# Altium schematic sheet 0261_GPU PSYS CIRCUIT.SchDoc
size 848 x 558 mm
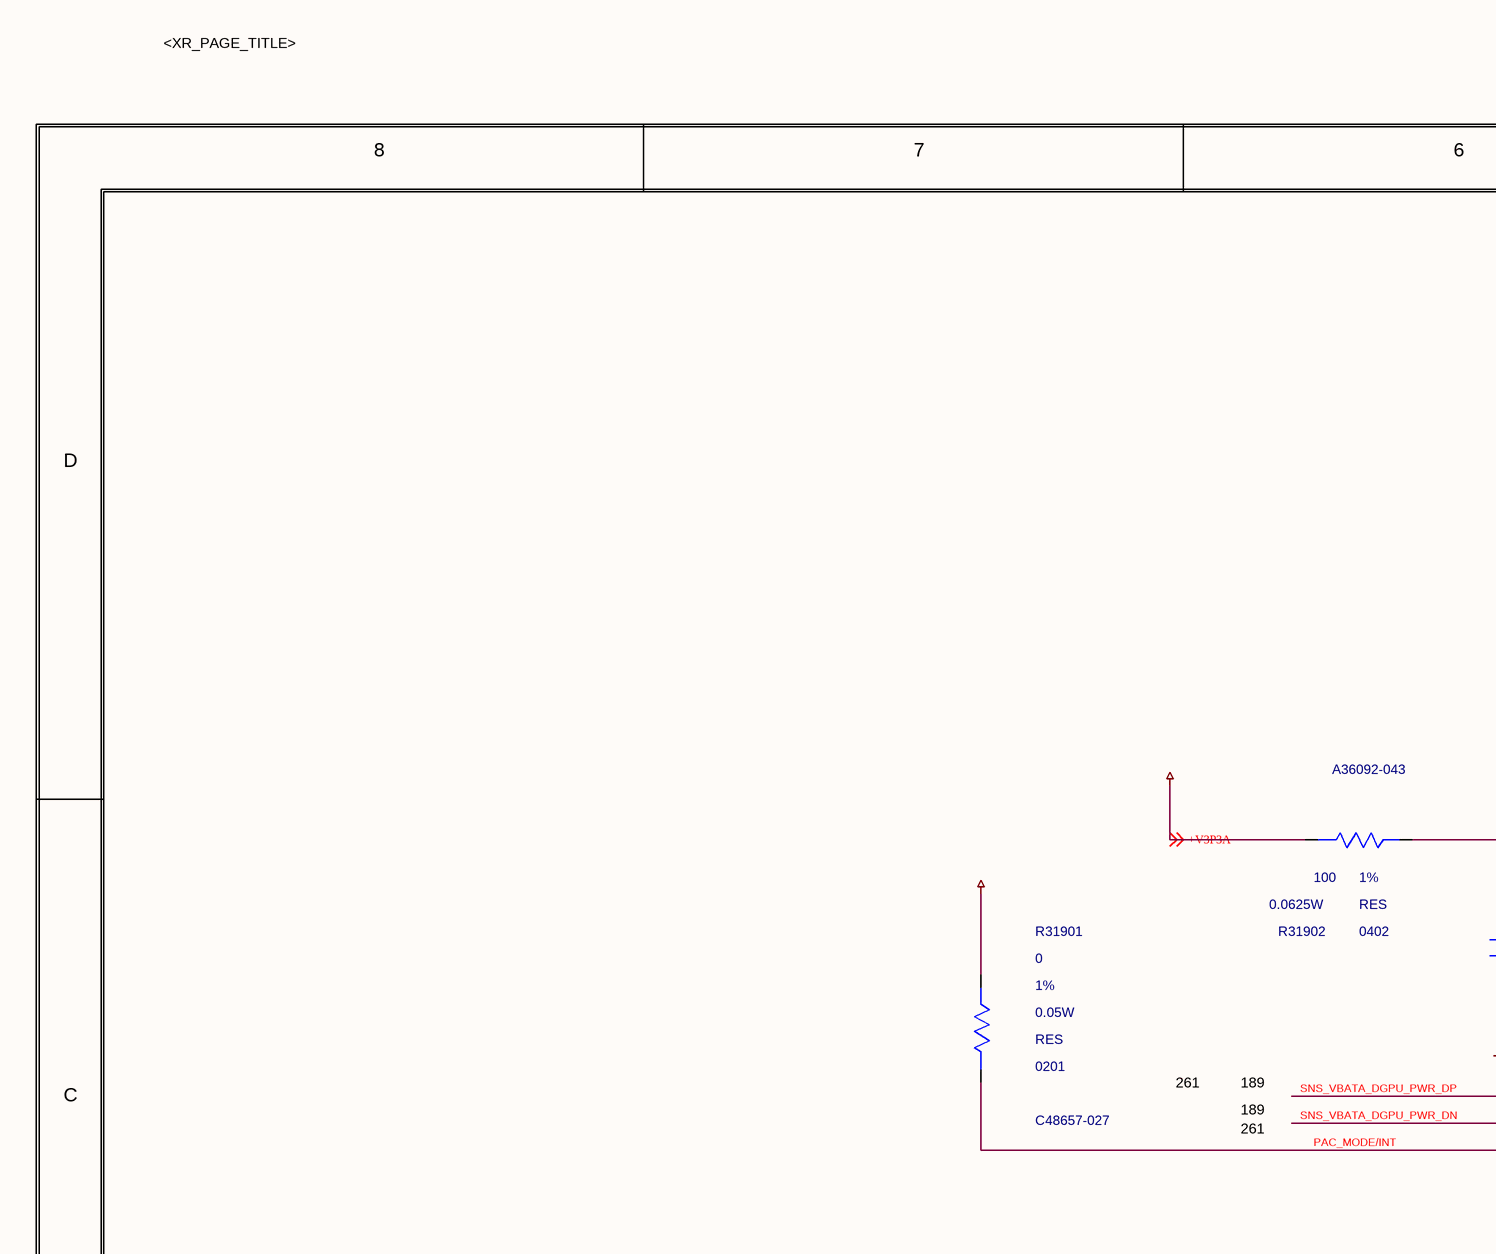
[diagram p0: 0261_GPU PSYS CIRCUIT.SchDoc, top left]
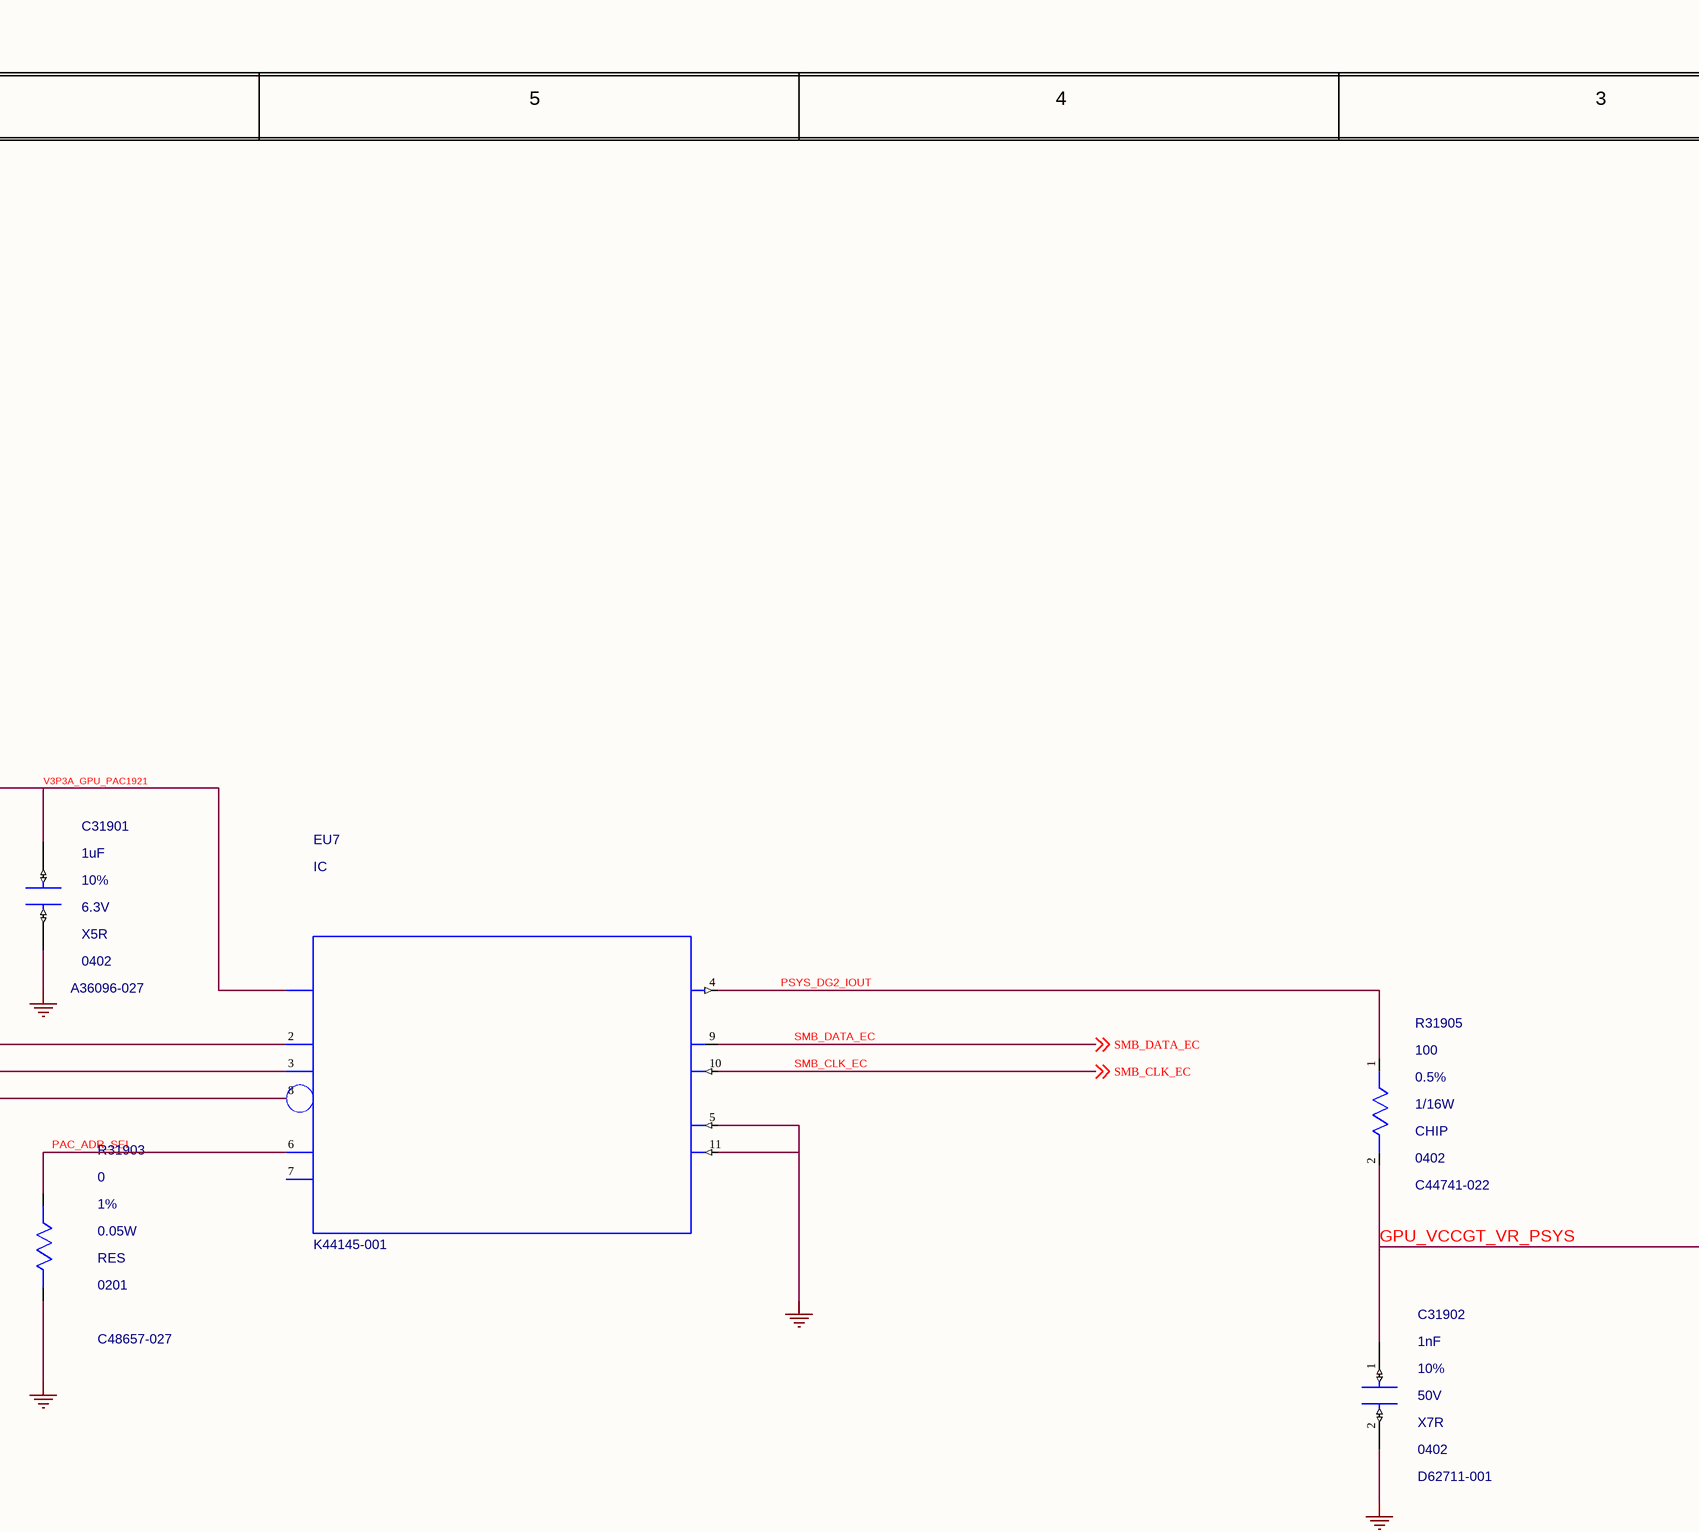
[diagram p1: 0261_GPU PSYS CIRCUIT.SchDoc, top middle]
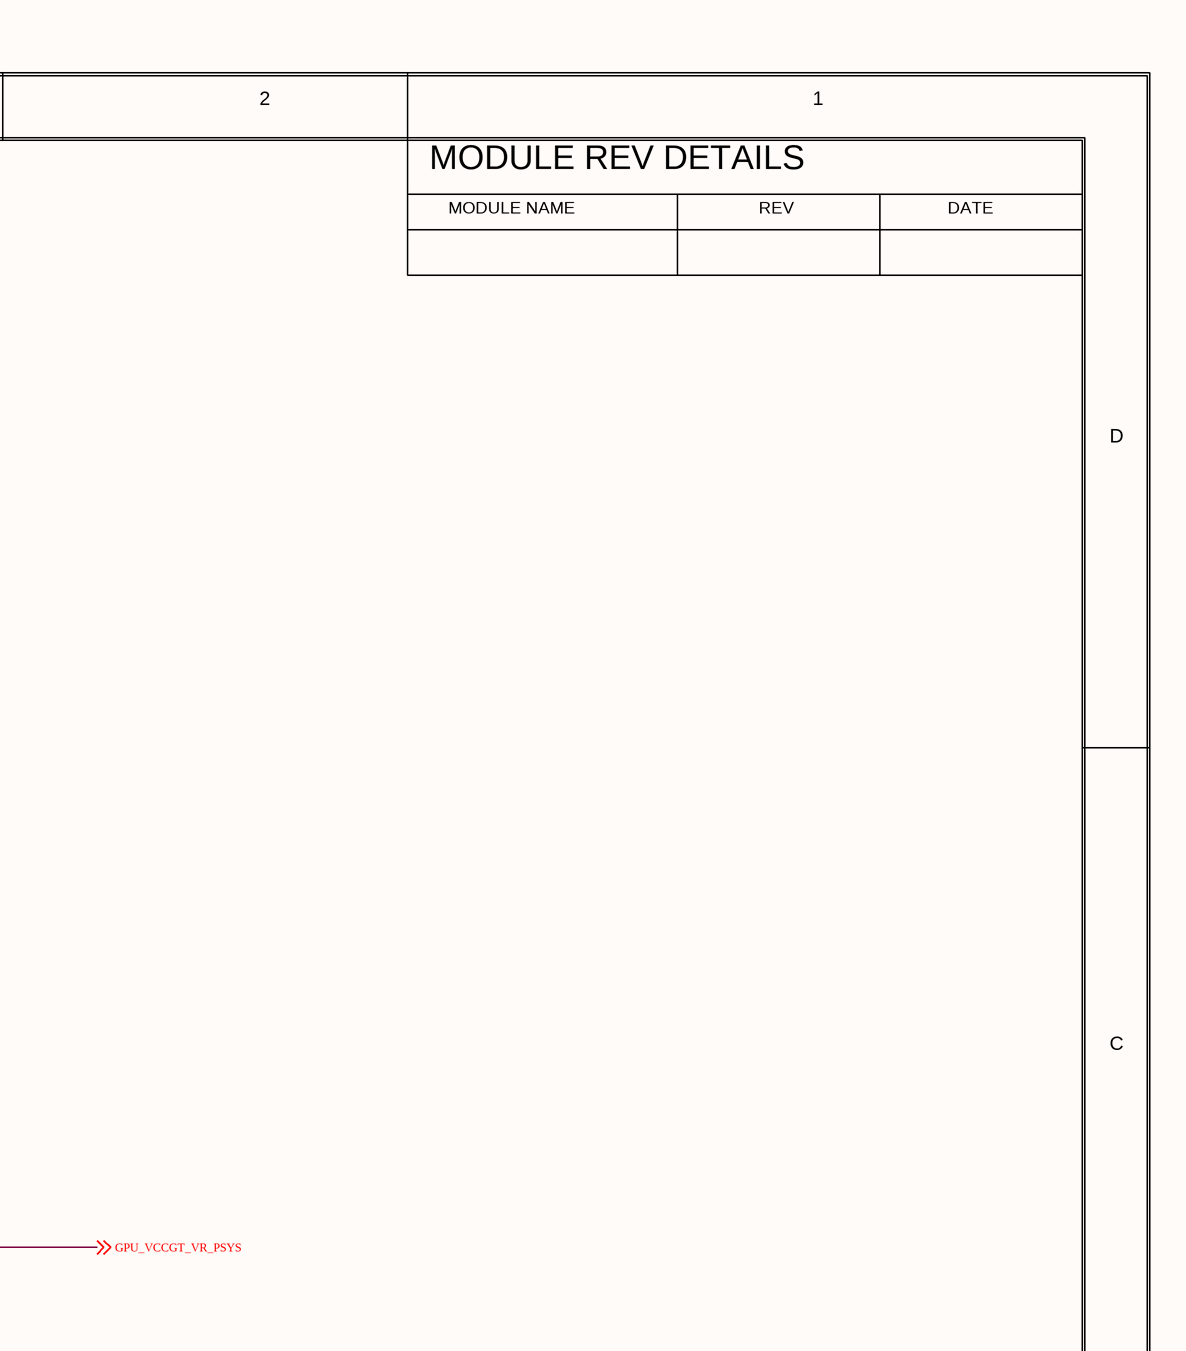
[diagram p2: 0261_GPU PSYS CIRCUIT.SchDoc, top right]
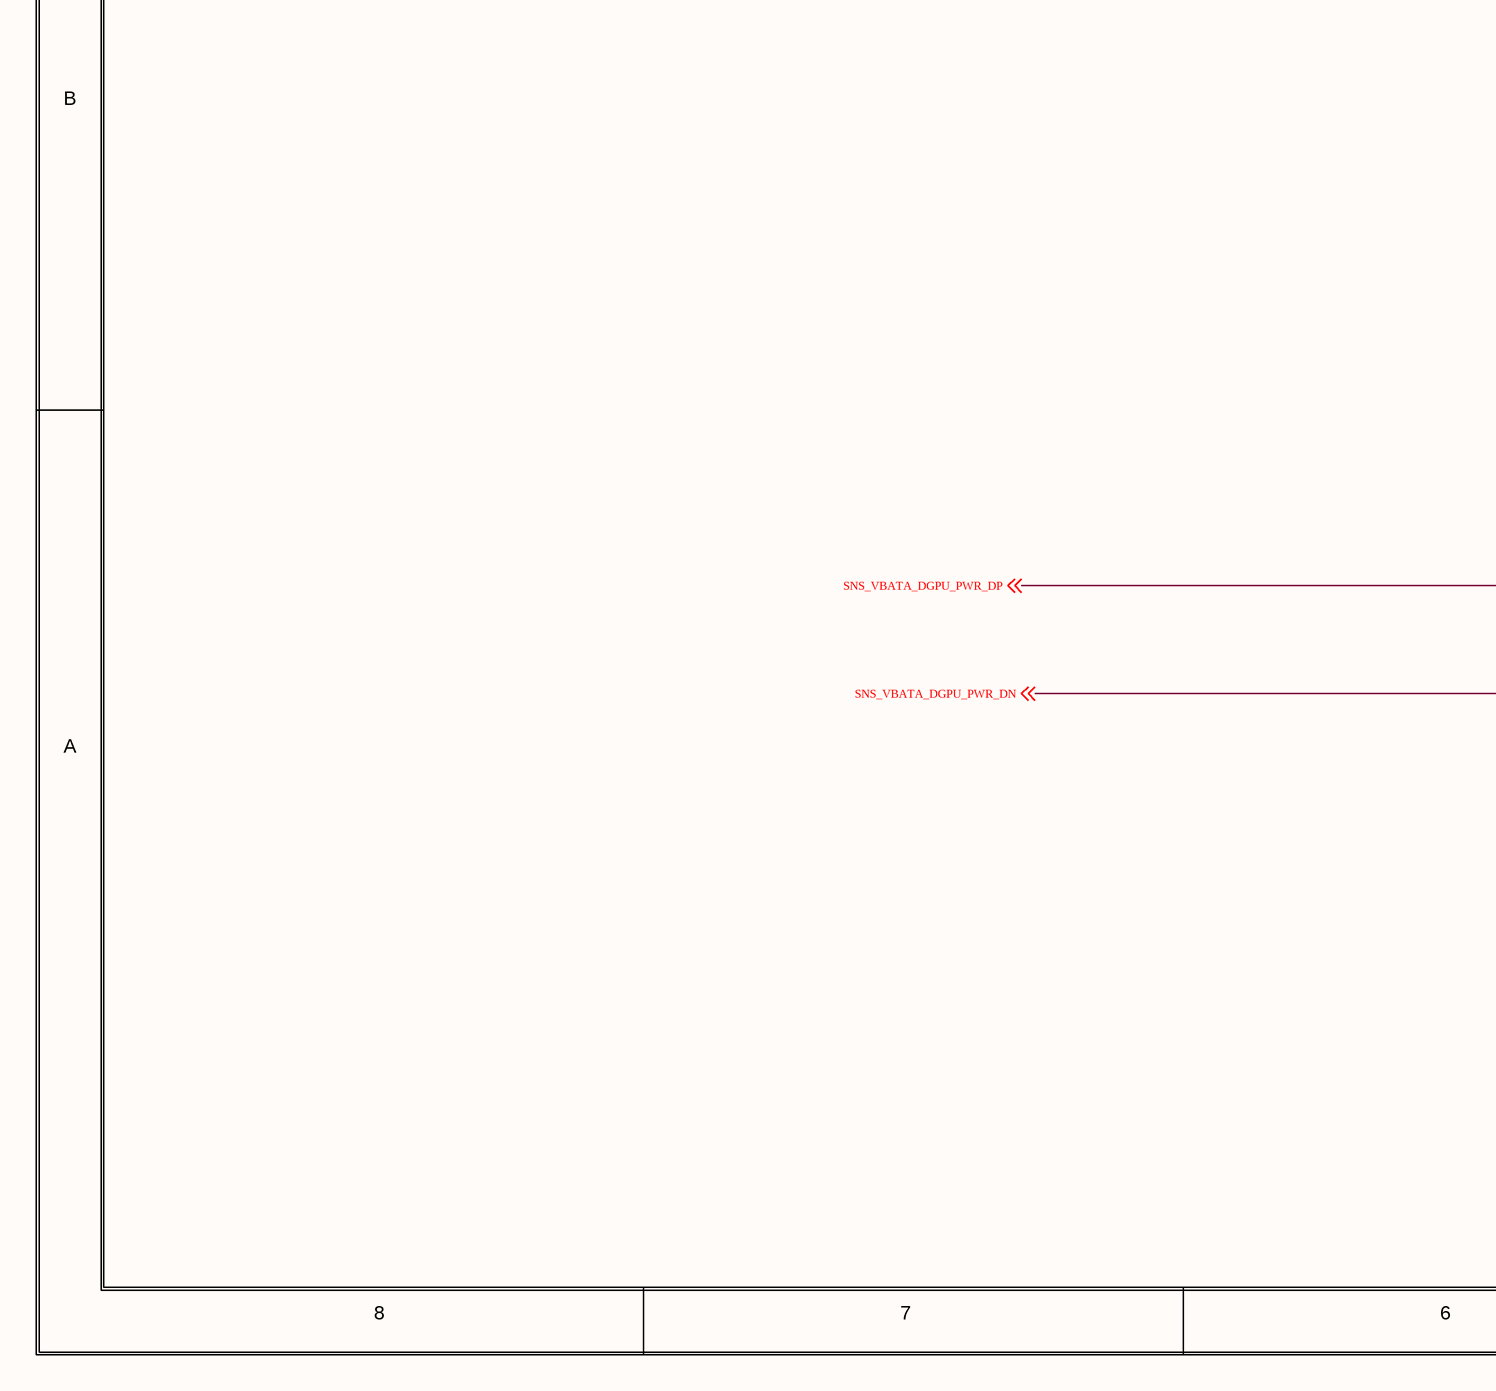
[diagram p3: 0261_GPU PSYS CIRCUIT.SchDoc, bottom left]
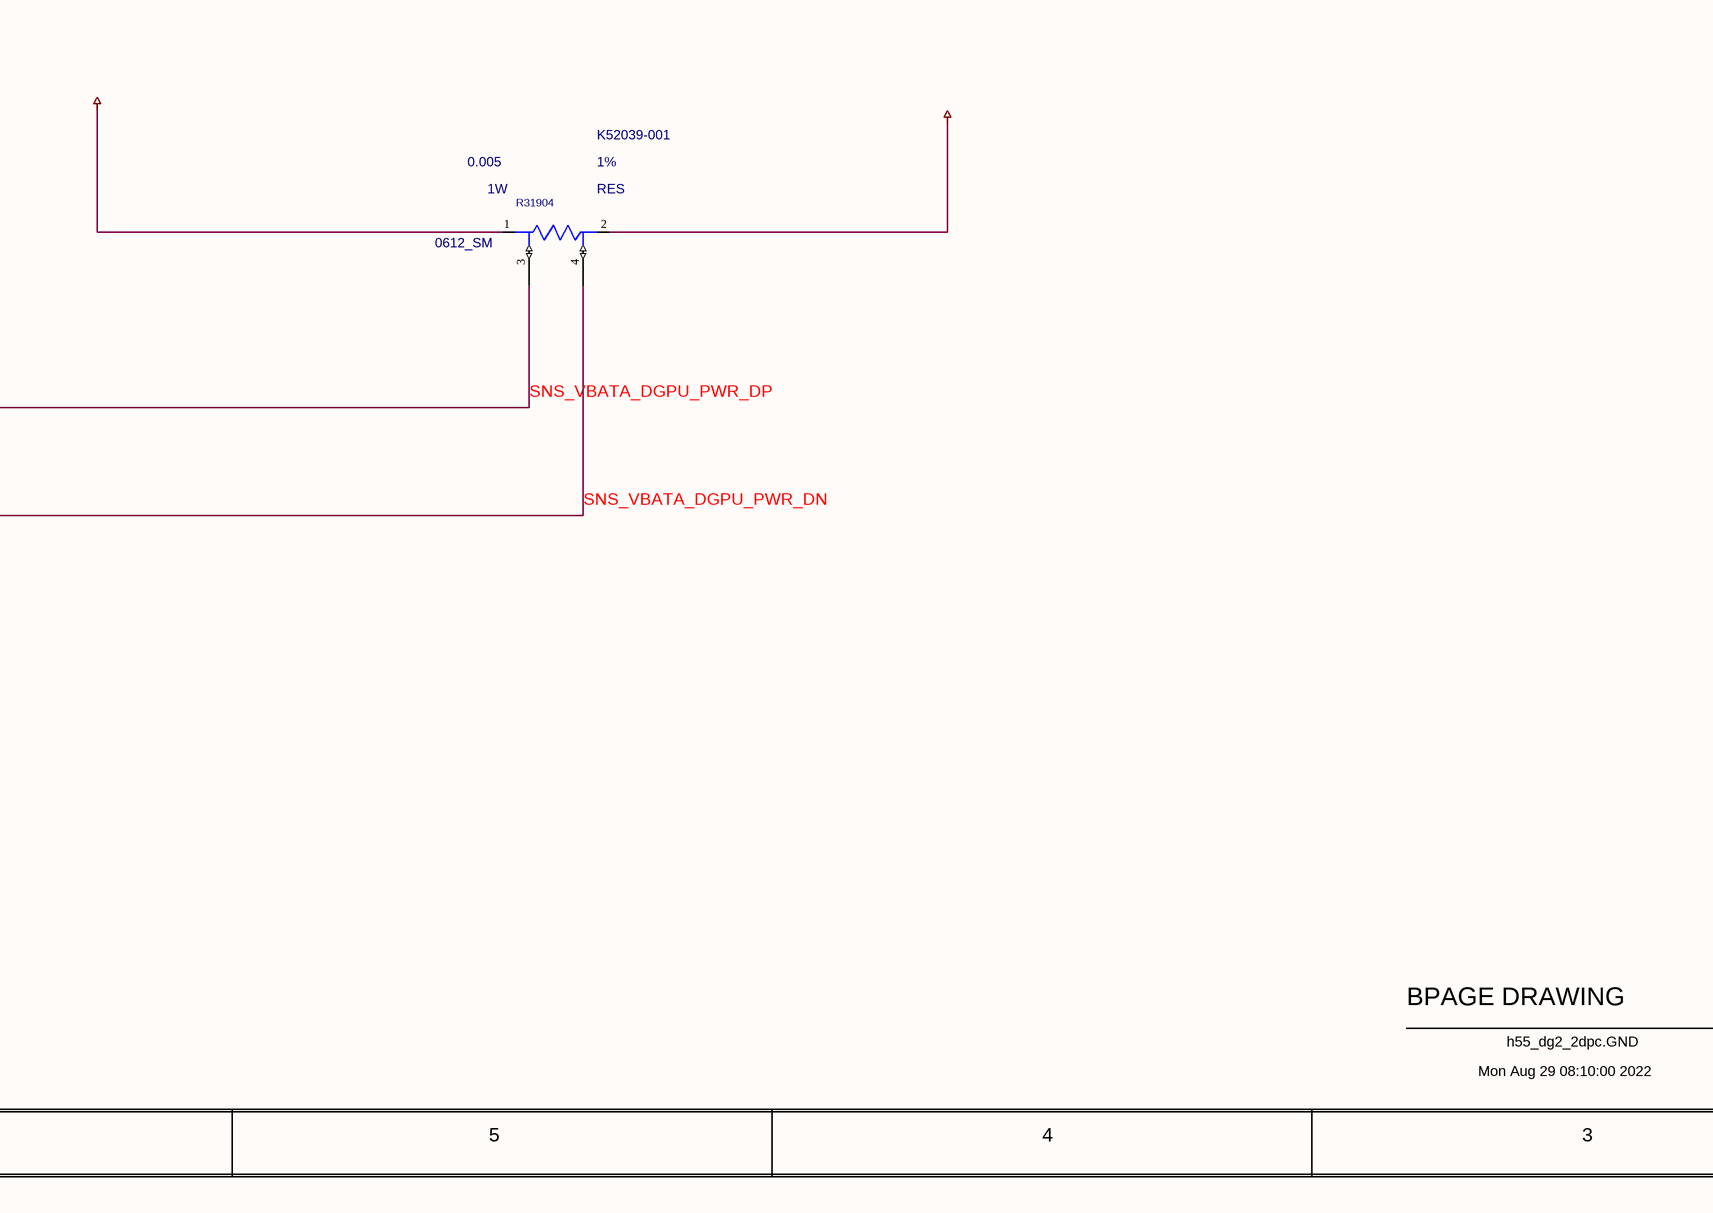
[diagram p4: 0261_GPU PSYS CIRCUIT.SchDoc, bottom middle]
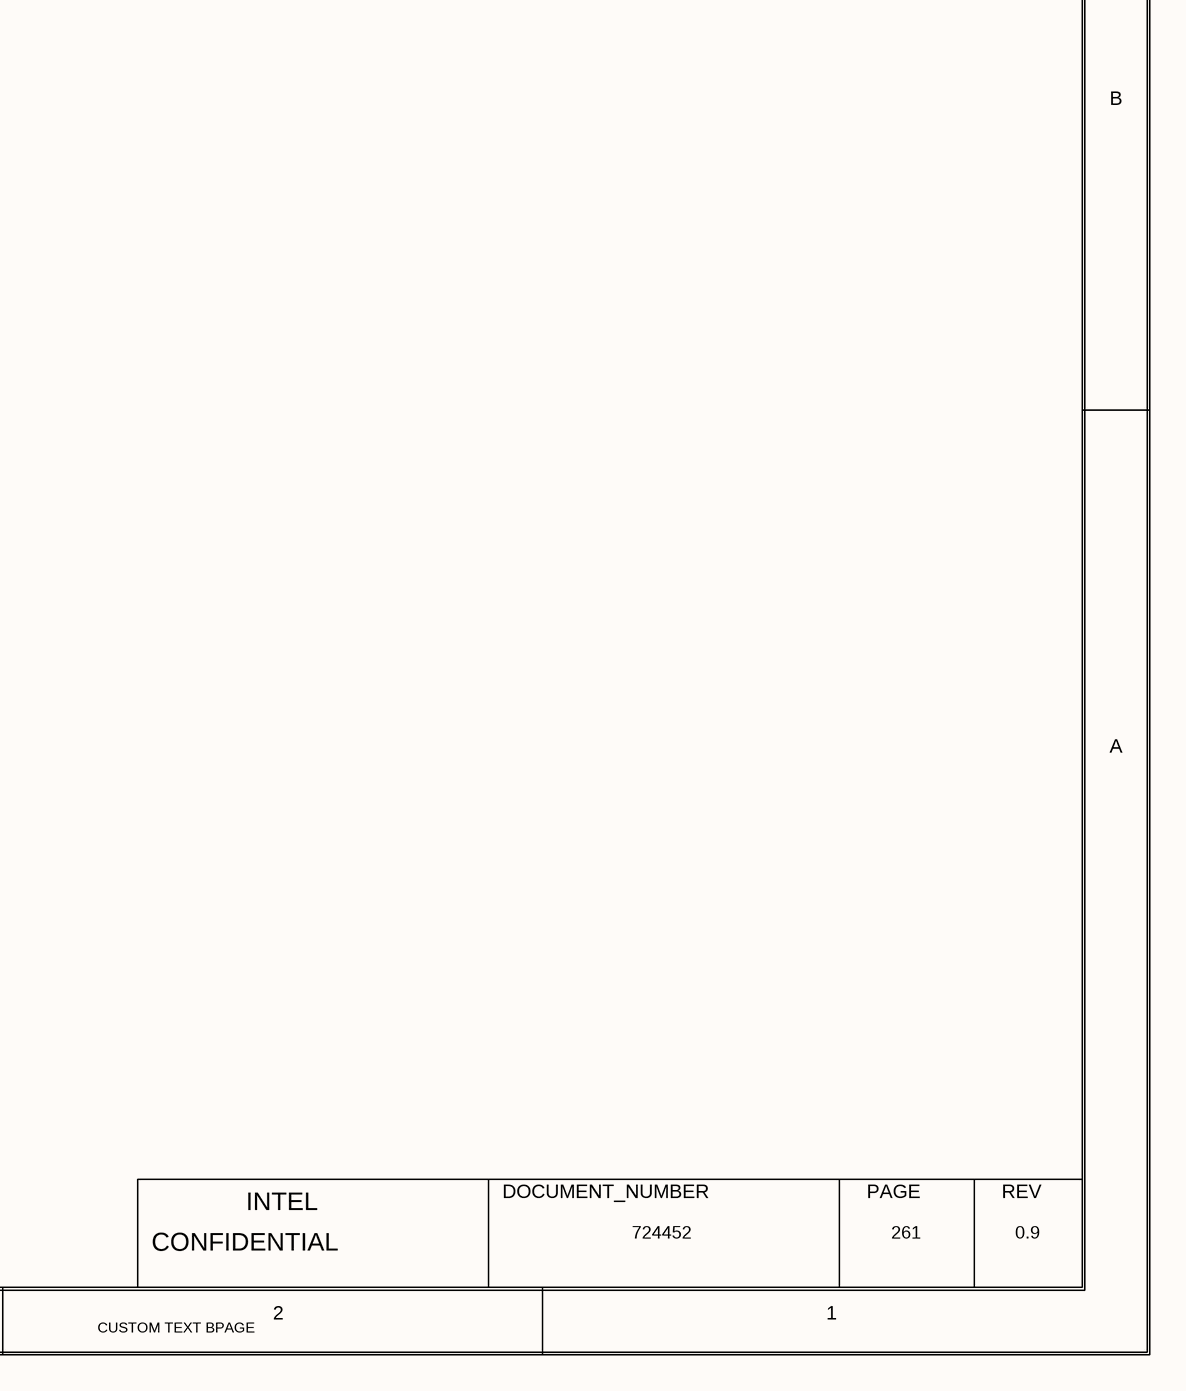
[diagram p5: 0261_GPU PSYS CIRCUIT.SchDoc, bottom right]

## Parts
C31901  1uF  MATERIAL: X5R  PACK_TYPE: 0402  PART_NUMBER: A36096-027  TOLERANCE: 10%  VOLTAGE: 6.3V  [CTK0_SM0402_1050X550_MA]
C31902  1nF  MATERIAL: X7R  PACK_TYPE: 0402  PART_NUMBER: D62711-001  TOLERANCE: 10%  VOLTAGE: 50V  [SMC0402IA]
EU7  MATERIAL: IC  PART_NUMBER: K44145-001  [CTK2_LCC10_S3000_500_DF1600X2300_MA]  (hidden comment: C_PAC1921)
R31901  0  MATERIAL: RES  PACK_TYPE: 0201  PART_NUMBER: C48657-027  TOLERANCE: 1%  WATTAGE: 0.05W  [CTK0_SM0201_630X330_MA]
R31902  100  MATERIAL: RES  PACK_TYPE: 0402  PART_NUMBER: A36092-043  TOLERANCE: 1%  WATTAGE: 0.0625W  [CTK2_SM0402_1050X550_MA]
R31903  0  MATERIAL: RES  PACK_TYPE: 0201  PART_NUMBER: C48657-027  TOLERANCE: 1%  WATTAGE: 0.05W  [CTK0_SM0201_630X330_MA]
R31904  0.005  MATERIAL: RES  PACK_TYPE: 0612_SM  PART_NUMBER: K52039-001  TOLERANCE: 1%  WATTAGE: 1W  [CTK0_SMR4_0612_1800X3450_MB_VR]
R31905  100  MATERIAL: CHIP  PACK_TYPE: 0402  PART_NUMBER: C44741-022  TOLERANCE: 0.5%  WATTAGE: 1/16W  [SMR0402IA]

## Nets
+V3P3A: R31901.1(A) R31902.1(A) ; off-sheet +V3P3A
+VBATA: R31904.1(PWRA)
+VBATA_DG2: R31904.2(PWRB)
GND: C31901.2(B) C31902.2(B) EU7.5(GND) EU7.11(THPAD) R31903.2(B)
VDD: EU7.1(VDD)
GPU_VCCGT_VR_PSYS: C31902.1(A) R31905.2(B) ; off-sheet GPU_VCCGT_VR_PSYS
PAC_ADR_SEL: EU7.6(ADDR_SEL) R31903.1(A)
PAC_MODE/INT: EU7.8(READ_N_INT) R31901.2(B)
PSYS_DG2_IOUT: EU7.4(OUT) R31905.1(A)
SMB_CLK_EC: EU7.10(SM_CLK) ; off-sheet SMB_CLK_EC
SMB_DATA_EC: EU7.9(SM_DATA) ; off-sheet SMB_DATA_EC
SNS_VBATA_DGPU_PWR_DN: EU7.3(SENSE_DN) R31904.4(SENB) ; off-sheet SNS_VBATA_DGPU_PWR_DN
SNS_VBATA_DGPU_PWR_DP: EU7.2(SENSE_DP) R31904.3(SENA) ; off-sheet SNS_VBATA_DGPU_PWR_DP
V3P3A_GPU_PAC1921: C31901.1(A) R31902.2(B)

Not connected (* = marked no-connect by the designer): EU7 7(RESERVED)

## Notes on the sheet
- <XR_PAGE_TITLE>
- 8
- 7
- 6
- 5
- 4
- 3
- 2
- 1
- MODULE REV DETAILS
- MODULE NAME
- REV
- DATE
- D
- C
- 261
- 189
- B
- A
- BPAGE DRAWING
- INTEL
- DOCUMENT_NUMBER
- PAGE
- Mon Aug 29 08:10:00 2022
- h55_dg2_2dpc.GND
- CONFIDENTIAL
- 724452
- 0.9
- CUSTOM TEXT BPAGE

## Library data of the parts
C31901 = C_CAP: CDS_PHYS_PART_NAME: C_CAP_0402-A36096-027,X5R,1UF,6.3V,10%,TK0,GENERIC; CDS_LMAN_SYM_OUTLINE: -50,50,50,-50; FP_TECH: TK0; IP: GENERIC; ROOM: NONE; OriginalSymbolOrigin: (-50,25); XY: (-5400,3600); VER: 1; ROT: 0; PHYS_PAGE: 261; LOCATION: C31901; DRAWING: @RVP1_ADL_SB_ADP_S_DDR5_SODIMM_2DPC_LIB.H55_DG2_2DPC(SCH_1):PAGE319; CDS_LIB: c_discrete; VARIANT: ?; PCB Footprint: CTK0_SM0402_1050X550_MA; CHIPS_PART_NAME: C_CAP; CDS_PART_NAME: C_CAP_0402-A36096-027,X5R,1UF,6.3V,10%,TK0,GENERIC; CDS_LOCATION: C31901
C31902 = CAP: CDS_PHYS_PART_NAME: CAP_0402-D62711-001,X7R,1NF,50V,10%,LPDB,GENERIC; OriginalSymbolOrigin: (-50,25); XY: (-2925,2675); VER: 1; ROT: 0; PHYS_PAGE: 261; LOCATION: C31902; IP: GENERIC; FP_TECH: LPDB; DRAWING: @RVP1_ADL_SB_ADP_S_DDR5_SODIMM_2DPC_LIB.H55_DG2_2DPC(SCH_1):PAGE319; CDS_LIB: discrete; PCB Footprint: SMC0402IA; CHIPS_PART_NAME: CAP; CDS_PART_NAME: CAP_0402-D62711-001,X7R,1NF,50V,10%,LPDB,GENERIC; CDS_LOCATION: C31902
EU7 = C_PAC1921: CDS_PHYS_PART_NAME: C_PAC1921_LCC-K44145-001,IC,PAC1921-1-AIA-TR,TK2,GENERIC; CDS_LMAN_SYM_OUTLINE: -350,250,350,-300; FP_TECH: TK2; IP: GENERIC; PACK_TYPE: LCC; ROOM: NONE; OriginalSymbolOrigin: (-400,250); XY: (-4550,3275); VER: 1; ROT: 0; PHYS_PAGE: 261; LOCATION: EU7; DRAWING: @RVP1_ADL_SB_ADP_S_DDR5_SODIMM_2DPC_LIB.H55_DG2_2DPC(SCH_1):PAGE319; CDS_LIB: local; VARIANT: ?; PCB Footprint: CTK2_LCC10_S3000_500_DF1600X2300_MA; SEC_TYPE: LCC; CHIPS_PART_NAME: C_PAC1921; CDS_PART_NAME: C_PAC1921_LCC-K44145-001,IC,PAC1921-1-AIA-TR,TK2,GENERIC; CDS_LOCATION: EU7
R31901 = C_RES: CDS_PHYS_PART_NAME: C_RES_0201-C48657-027,RES,0,1%,0.05W,TK0,GENERIC; CDS_LMAN_SYM_OUTLINE: -50,50,50,-50; FP_TECH: TK0; IP: GENERIC; ROOM: NONE; OriginalSymbolOrigin: (-25,75); XY: (-6375,3450); VER: 2; PHYS_PAGE: 261; LOCATION: R31901; DRAWING: @RVP1_ADL_SB_ADP_S_DDR5_SODIMM_2DPC_LIB.H55_DG2_2DPC(SCH_1):PAGE319; CDS_LIB: c_discrete; VARIANT: ?; PCB Footprint: CTK0_SM0201_630X330_MA; ROT: 0; CHIPS_PART_NAME: C_RES; CDS_PART_NAME: C_RES_0201-C48657-027,RES,0,1%,0.05W,TK0,GENERIC; CDS_LOCATION: R31901
R31902 = C_RES#1: CHIPS_PART_NAME: C_RES; CDS_PHYS_PART_NAME: C_RES_0402-A36092-043,RES,100,1%,0.0625W,TK2,GENERIC; CDS_LMAN_SYM_OUTLINE: -50,50,50,-50; FP_TECH: TK2; IP: GENERIC; ROOM: NONE; OriginalSymbolOrigin: (-75,25); XY: (-5675,3800); VER: 1; ROT: 0; PHYS_PAGE: 261; LOCATION: R31902; DRAWING: @RVP1_ADL_SB_ADP_S_DDR5_SODIMM_2DPC_LIB.H55_DG2_2DPC(SCH_1):PAGE319; CDS_LIB: c_discrete; VARIANT: ?; PCB Footprint: CTK2_SM0402_1050X550_MA; CDS_PART_NAME: C_RES_0402-A36092-043,RES,100,1%,0.0625W,TK2,GENERIC; CDS_LOCATION: R31902
R31903 = C_RES: CDS_PHYS_PART_NAME: C_RES_0201-C48657-027,RES,0,1%,0.05W,TK0,GENERIC; CDS_LMAN_SYM_OUTLINE: -50,50,50,-50; FP_TECH: TK0; IP: GENERIC; ROOM: NONE; OriginalSymbolOrigin: (-25,75); XY: (-5400,2950); VER: 2; PHYS_PAGE: 261; LOCATION: R31903; DRAWING: @RVP1_ADL_SB_ADP_S_DDR5_SODIMM_2DPC_LIB.H55_DG2_2DPC(SCH_1):PAGE319; CDS_LIB: c_discrete; VARIANT: ?; PCB Footprint: CTK0_SM0201_630X330_MA; ROT: 0; CHIPS_PART_NAME: C_RES; CDS_PART_NAME: C_RES_0201-C48657-027,RES,0,1%,0.05W,TK0,GENERIC; CDS_LOCATION: R31903
R31904 = C_RES_4TERM: CDS_PHYS_PART_NAME: C_RES_4TERM_0612_SM-K52039-001,RES,0.005,1%,1W,TK0,GENERIC; CDS_LMAN_SYM_OUTLINE: -50,50,50,-50; FP_TECH: TK0; IP: GENERIC; ROOM: NONE; OriginalSymbolOrigin: (-75,25); XY: (-4400,1625); VER: 1; SUB_ROOM_2: PMR; SUB_ROOM_1: V_CHRG_LDO; ROT: 0; PHYS_PAGE: 261; LOCATION: R31904; DRAWING: @RVP1_ADL_SB_ADP_S_DDR5_SODIMM_2DPC_LIB.H55_DG2_2DPC(SCH_1):PAGE319; CDS_LIB: c_discrete; VARIANT: ?; PCB Footprint: CTK0_SMR4_0612_1800X3450_MB_VR; SUB_ROOM: PMR; CHIPS_PART_NAME: C_RES_4TERM; CDS_PART_NAME: C_RES_4TERM_0612_SM-K52039-001,RES,0.005,1%,1W,TK0,GENERIC; CDS_LOCATION: R31904
R31905 = RES: CDS_PHYS_PART_NAME: RES_0402-C44741-022,CHIP,100,0.5%,1/16W,LPDB,GENERIC; OriginalSymbolOrigin: (-25,75); XY: (-2925,3200); VER: 2; ROT: 0; PHYS_PAGE: 261; LOCATION: R31905; IP: GENERIC; FP_TECH: LPDB; DRAWING: @RVP1_ADL_SB_ADP_S_DDR5_SODIMM_2DPC_LIB.H55_DG2_2DPC(SCH_1):PAGE319; CDS_LIB: discrete; PCB Footprint: SMR0402IA; CHIPS_PART_NAME: RES; CDS_PART_NAME: RES_0402-C44741-022,CHIP,100,0.5%,1/16W,LPDB,GENERIC; CDS_LOCATION: R31905